# EAGLE design FTDI_Extender (EAGLE 9.0.1)
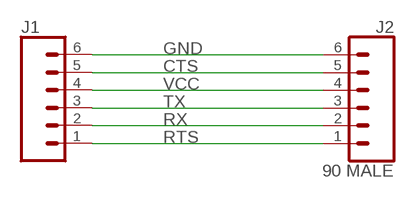
[diagram p0: schematic, sheet 1]

## Parts
J1  CONN_0690_MALE  [1X06_90_MALE]
J2  90 MALE  CONN_0690_FEMALE  [1X06_90_FEMALE]

## Nets
CTS: J1.5 J2.5
GND: J1.6 J2.6
RTS: J1.1 J2.1
RX: J1.2 J2.2
TX: J1.3 J2.3
VCC: J1.4 J2.4

## Library data of the parts
J1 J2 = FTDI_Extender:CONN_06: Multi connection point. Often used as Generic Header-pin footprint for 0.1 inch spaced/style header connections On any of the 0.1 inch spaced packages, you can populate with these: Break Away Headers - Straight <https://www.sparkfun.com/products/116> (PRT-00116) Break Away Male Headers - Right Angle <https://www.sparkfun.com/products/553> (PRT-00553) Female Headers <https://www.sparkfun.com/products/115> (PRT-00115) Break Away Headers - Machine Pin <https://www.sparkfun.com/products/117> (PRT-00117) Break Away Female Headers - Swiss Machine Pin <https://www.sparkfun.com/products/743> (PRT-00743) Arduino Stackable Header - 6 Pin <https://www.sparkfun.com/products/9280> (PRT-09280) For SCREWTERMINALS and SPRING TERMINALS visit here: Screw Terimnals on SparkFun.com <https://www.sparkfun.com/search/results?term=Screw+Terminals> (5mm/3.5mm/2.54mm spacing) This device is also useful as a general connection point to wire up your design to another part of your project. Our various solder wires solder well into these plated through hole pads. Hook-Up Wire - Assortment (Stranded, 22 AWG) <https://www.sparkfun.com/products/11375> (PRT-11375) Hook-Up Wire - Assortment (Solid Core, 22 AWG) <https://www.sparkfun.com/products/11367> (PRT-11367) View the entire wire category on our website here <https://www.sparkfun.com/categories/141>

## Board
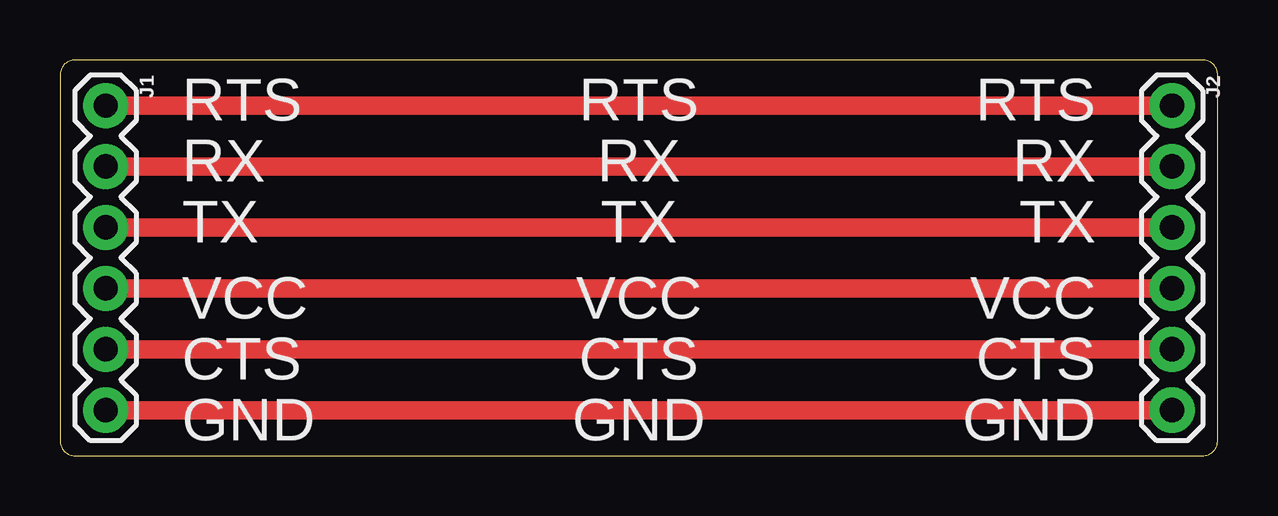
[diagram p1: board, top side]

Size 48.26 x 16.51 mm. Coordinates in mm from the lower left corner, seen from the top.
Outline: 0,15.88 0,0.64 arc90 0.64,0 47.62,0 arc90 48.26,0.64 48.26,15.88 arc90 47.62,16.51 0.64,16.51 arc90 0,15.88
Copper layers (1*16): Top 0.035559375mm / dielectric 1.6mm / Bottom 0.035559375mm
Design rules "oshpark-2layer-auto-routing": minimum track width 10mil, minimum drill 10mil, track to track 10mil, track to pad 8mil, pad to pad 8mil, via to via 8mil, smd to smd 6mil, copper to edge 15mil, drill to drill 6mil, minimum pad ring 6mil, minimum via ring 6mil, stop-mask expansion 2.5mil, vias tented up to drill 0mil, thermal gap 10mil

### Footprints (pad centres in the part's own frame; a part is rotated, then mirrored left to right if it is on the bottom)
1X06_90_MALE = drill 1.016 pad 1.88: 1 0,0; 2 2.54,0; 3 5.08,0; 4 7.62,0; 5 10.16,0; 6 12.7,0
1X06_90_FEMALE = drill 1.016 pad 1.88: 1 0,0; 2 2.54,0; 3 5.08,0; 4 7.62,0; 5 10.16,0; 6 12.7,0

### Placement (x,y rotation side)
J1  1.91,14.61 270 top
J2  46.35,14.61 270 top

### Tracks (layer width: path | path; a pad name or v marks a point on that pad's centre or on a via)
CTS
  Top 0.762: J1.5 J2.5
GND
  Top 0.762: J1.6 J2.6
RTS
  Top 0.762: J1.1 J2.1
RX
  Top 0.762: J1.2 J2.2
TX
  Top 0.762: J1.3 J2.3
VCC
  Top 0.762: J1.4 J2.4

### Text on the board
tNames: RTS | RTS | RTS | RX | RX | RX | TX | TX | TX | VCC | VCC | VCC | CTS | CTS | CTS | GND | GND | GND
bNames: RTS | RTS | RTS | RX | RX | RX | TX | TX | TX | VCC | VCC | VCC | CTS | CTS | CTS | GND | GND | GND